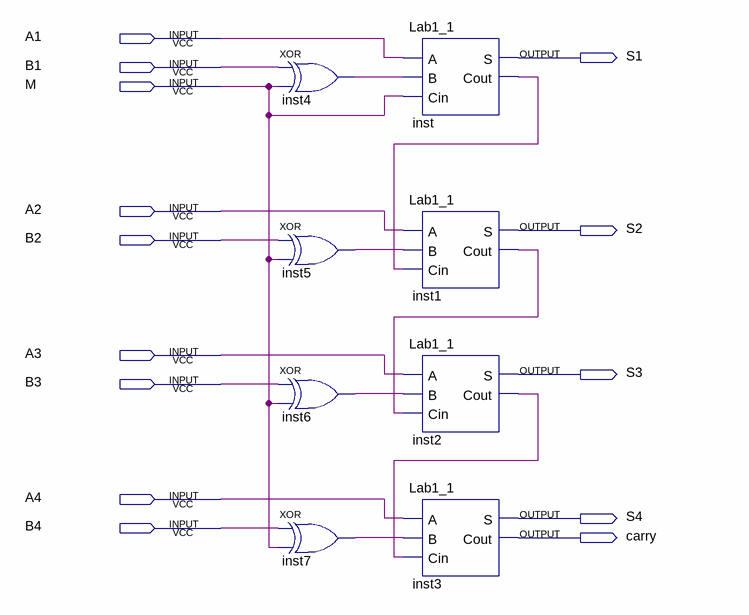
[diagram p0: schematic sheet]
// Quartus schematic Lab1_2.bdf as structural Verilog: 8 symbols, 14 pins
module Lab1_2 (
  input  A1,
  input  B1,
  input  M,
  input  A2,
  input  B2,
  input  A3,
  input  B3,
  input  A4,
  input  B4,
  output S1,
  output S2,
  output S3,
  output S4,
  output carry
);

  wire inst1_cout, inst2_cout, inst4_out, inst5_out, inst6_out, inst7_out, inst_cout;

  xor inst4 (inst4_out, B1, M);
  xor inst5 (inst5_out, B2, M);
  xor inst6 (inst6_out, B3, M);
  xor inst7 (inst7_out, B4, M);
  Lab1_1 inst (.A(A1), .B(inst4_out), .Cin(M), .S(S1), .Cout(inst_cout));
  Lab1_1 inst1 (.A(A2), .B(inst5_out), .Cin(inst_cout), .S(S2), .Cout(inst1_cout));
  Lab1_1 inst2 (.A(A3), .B(inst6_out), .Cin(inst1_cout), .S(S3), .Cout(inst2_cout));
  Lab1_1 inst3 (.A(A4), .B(inst7_out), .Cin(inst2_cout), .S(S4), .Cout(carry));
endmodule
